# EAGLE design ATmega8_panorama-photo_v2 (EAGLE 5.10)
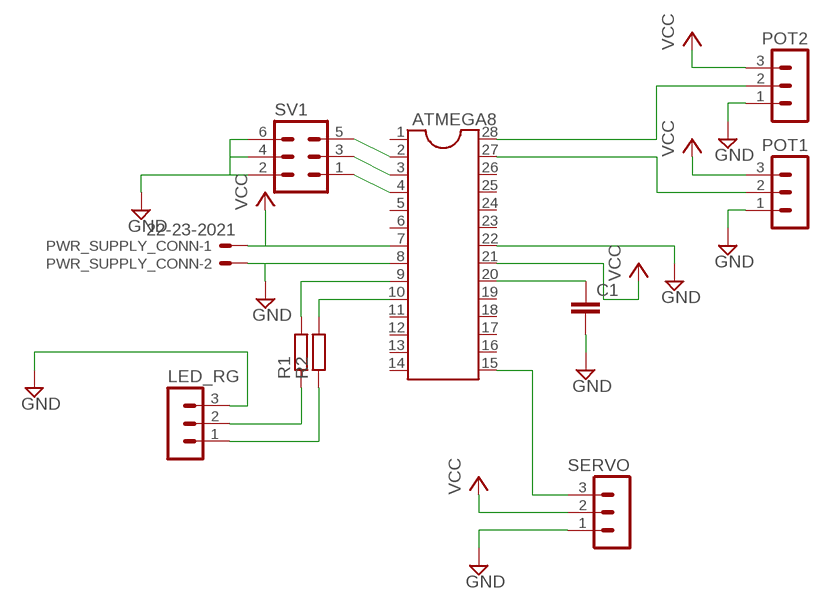
[diagram p0: schematic, sheet 1]

## Parts
ATMEGA8  DIL28-3  [DIL28-3]
C1  C5/7.2  [C5B7.2]
LED_RG  MA03-1  [MA03-1]
POT1  MA03-1  [MA03-1]
POT2  MA03-1  [MA03-1]
PWR_SUPPLY_CONN  22-23-2021  [22-23-2021]
R1  R-EU_0204/7  [0204/7]
R2  R-EU_0204/7  [0204/7]
SERVO  MA03-1  [MA03-1]
SV1  MA03-2  [MA03-2]

## Nets
AVCC: ATMEGA8.20 C1.1
BTN_INPUT1: ATMEGA8.2 SV1.5
BTN_INPUT2: ATMEGA8.3 SV1.3
BTN_INPUT3: ATMEGA8.4 SV1.1
GND: ATMEGA8.8 ATMEGA8.22 C1.2 LED_RG.3 POT1.1 POT2.1 PWR_SUPPLY_CONN.2 SERVO.1 SV1.2 SV1.4 SV1.6
LED1_COLOR1: LED_RG.1 R2.1
LED1_COLOR2: ATMEGA8.9 R1.2
N$2: ATMEGA8.10 R2.2
N$4: LED_RG.2 R1.1
POT1_ADC: ATMEGA8.27 POT1.2
POT2_ADC: ATMEGA8.28 POT2.2
SERVO1_PWM: ATMEGA8.15 SERVO.3
VCC: ATMEGA8.7 ATMEGA8.21 POT1.3 POT2.3 PWR_SUPPLY_CONN.1 SERVO.2
Unconnected: ATMEGA8.1 ATMEGA8.5 ATMEGA8.6 ATMEGA8.11 ATMEGA8.12 ATMEGA8.13 ATMEGA8.14 ATMEGA8.16 ATMEGA8.17 ATMEGA8.18 ATMEGA8.19 ATMEGA8.23 ATMEGA8.24 ATMEGA8.25 ATMEGA8.26

## Library data of the parts
ATMEGA8 = ic-package:DIL28: Dual In Line
C1 = capacitor-wima:C: CAPACITOR naming: grid - package width
LED_RG POT1 POT2 SERVO = con-lstb:MA03-1: PIN HEADER
PWR_SUPPLY_CONN = con-molex:22-23-2021: .100" (2.54mm) Center Header - 2 Pin
R1 R2 = resistor:R-EU_: RESISTOR, European symbol
SV1 = con-lstb:MA03-2: PIN HEADER

## Board
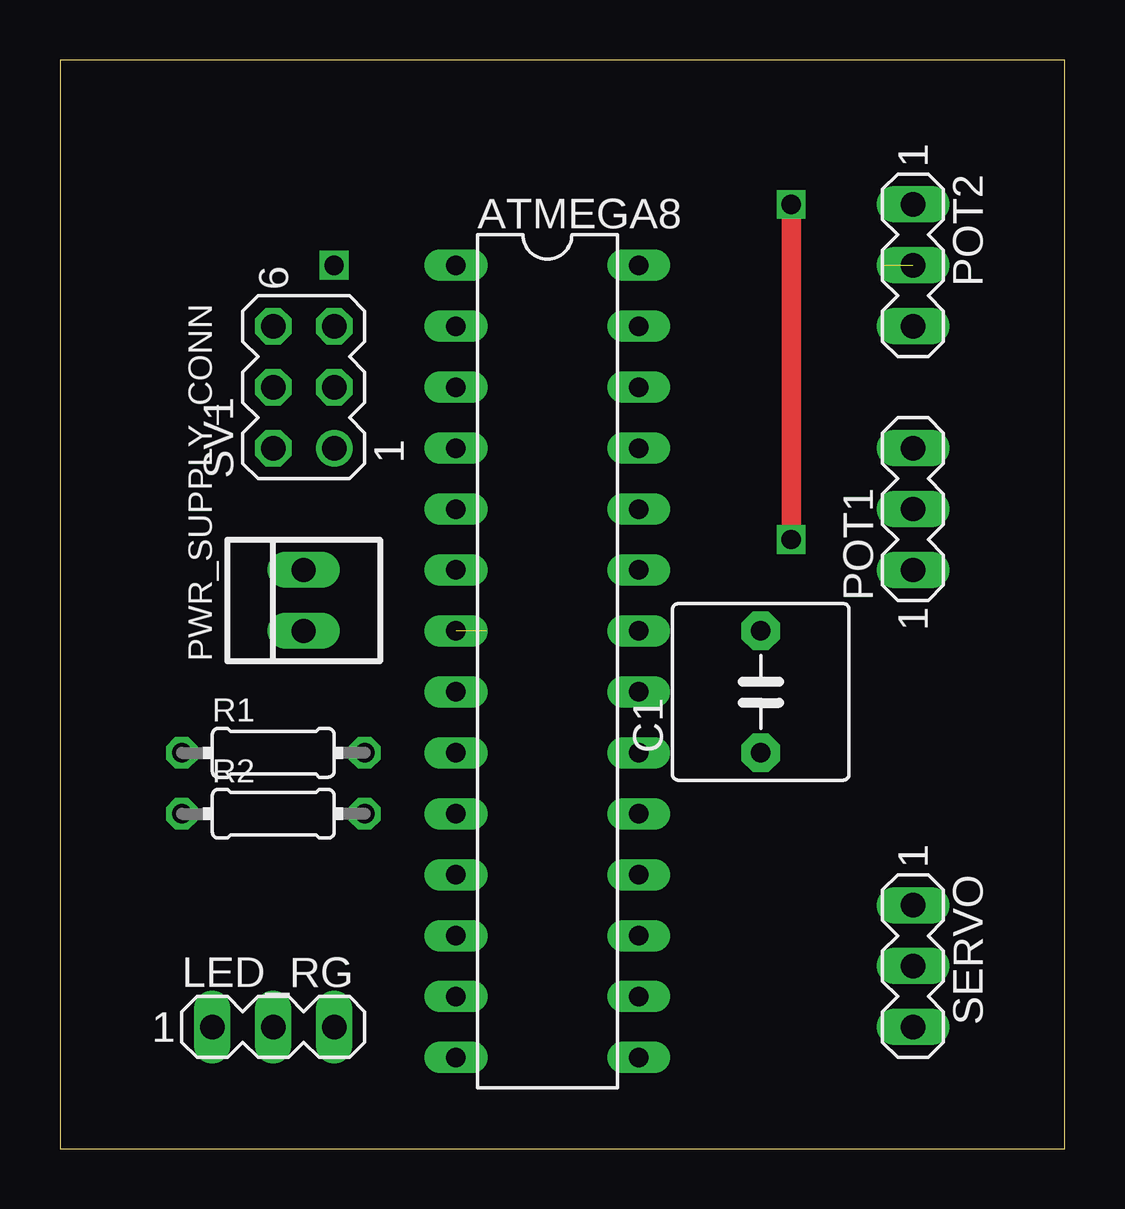
[diagram p1: board, top side]
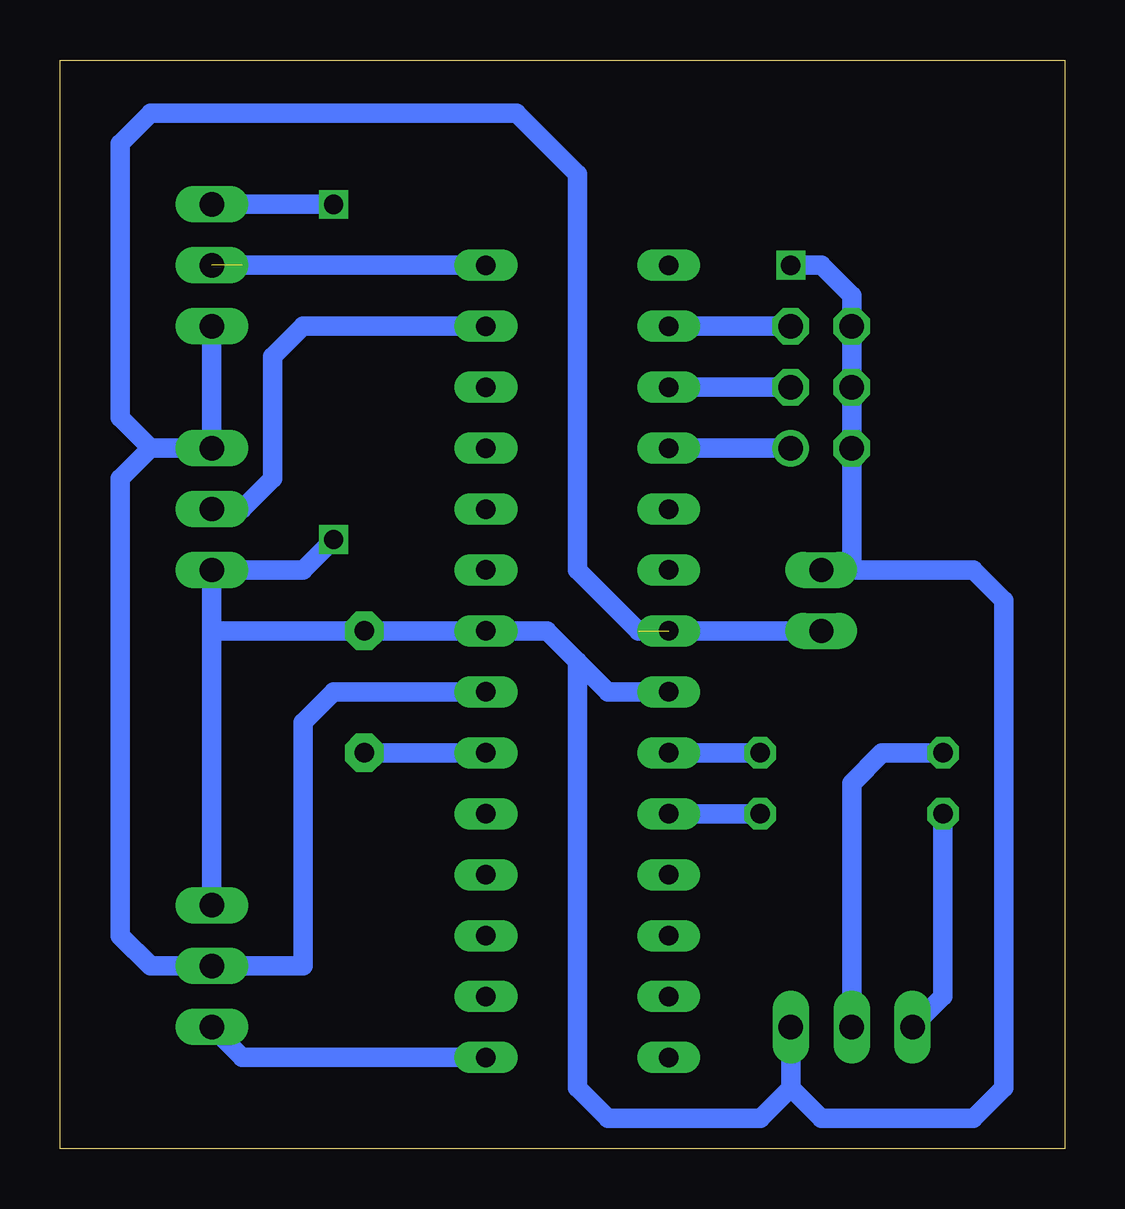
[diagram p2: board, bottom side, seen from below]

Size 41.89 x 45.39 mm. Coordinates in mm from the lower left corner, seen from the top.
Outline: 0,0 41.89,0 41.89,45.39 0,45.39 0,0
Copper layers (1*16): Top 0.035mm / dielectric 1.5mm / Bottom 0.035mm
Design rules "default": minimum track width 10mil, minimum drill 24mil, track to track 8mil, track to pad 8mil, pad to pad 8mil, via to via 8mil, smd to smd 8mil, copper to edge 40mil, drill to drill 8mil, minimum pad ring 10mil, minimum via ring 8mil, stop-mask expansion 4mil, vias tented up to drill 0mil, thermal gap 10mil

### Footprints (pad centres in the part's own frame; a part is rotated, then mirrored left to right if it is on the bottom)
DIL28-3 = drill 0.813 long: 1 -16.51,-3.81; 2 -13.97,-3.81; 3 -11.43,-3.81; 4 -8.89,-3.81; 5 -6.35,-3.81; 6 -3.81,-3.81; 7 -1.27,-3.81; 8 1.27,-3.81; 9 3.81,-3.81; 10 6.35,-3.81; 11 8.89,-3.81; 12 11.43,-3.81; 13 13.97,-3.81; 14 16.51,-3.81; 15 16.51,3.81; 16 13.97,3.81; 17 11.43,3.81; 18 8.89,3.81; 19 6.35,3.81; 20 3.81,3.81; 21 1.27,3.81; 22 -1.27,3.81; 23 -3.81,3.81; 24 -6.35,3.81; 25 -8.89,3.81; 26 -11.43,3.81; 27 -13.97,3.81; 28 -16.51,3.81
C5B7.2 = drill 0.813 pad 1.6 octagon: 1 -2.54,0; 2 2.54,0
MA03-1 = drill 1.016 long: 1 -2.54,0; 2 0,0; 3 2.54,0
22-23-2021 = drill 1 long: 1 -1.27,0; 2 1.27,0
0204/7 = drill 0.813 octagon: 1 -3.81,0; 2 3.81,0
MA03-2 = drill 1.016 round: 1 -2.54,-1.27 | drill 1.016 octagon: 2 -2.54,1.27; 3 0,-1.27; 4 0,1.27; 5 2.54,-1.27; 6 2.54,1.27

### Placement (x,y rotation side)
ATMEGA8  20.32,20.32 270 top
C1  29.21,19.05 90 top
LED_RG  8.89,5.08 0 top
POT1  35.56,26.67 90 top
POT2  35.56,36.83 270 top
PWR_SUPPLY_CONN  10.16,22.86 90 top
R1  8.89,16.51 0 top
R2  8.89,13.97 0 top
SERVO  35.56,7.62 270 top
SV1  10.16,31.75 90 top

### Tracks (layer width: path | path; a pad name or v marks a point on that pad's centre or on a via)
AVCC
  Bottom 0.813: ATMEGA8.20 C1.1
BTN_INPUT1
  Bottom 0.813: SV1.5 ATMEGA8.2
BTN_INPUT2
  Bottom 0.813: SV1.3 ATMEGA8.3
BTN_INPUT3
  Bottom 0.813: SV1.1 ATMEGA8.4
GND  (via drill 0.8)
  Top 0.813: v30.48,25.4 v30.48,39.37
  Bottom 0.813: 20.32,20.32 21.59,21.59 ATMEGA8.22 C1.2 35.56,21.59 | 35.56,21.59 POT1.1 31.75,24.13 v30.48,25.4 | 35.56,21.59 SERVO.1 | v30.48,39.37 POT2.1 | 11.43,2.54 LED_RG.3 | 11.43,2.54 10.16,1.27 3.81,1.27 2.54,2.54 2.54,22.86 3.81,24.13 8.89,24.13 | ATMEGA8.8 19.05,19.05 20.32,20.32 | 20.32,20.32 20.32,2.54 19.05,1.27 12.7,1.27 11.43,2.54 | 8.89,24.13 PWR_SUPPLY_CONN.2 | 8.89,24.13 SV1.2 SV1.4 SV1.6 8.89,35.56 10.16,36.83 v11.43,36.83
LED1_COLOR1
  Bottom 0.813: R2.1 5.08,6.35 LED_RG.1
LED1_COLOR2
  Bottom 0.813: R1.2 ATMEGA8.9
N$1  (via drill 0.8)
  other vias: 30.48,25.4
N$2
  Bottom 0.813: R2.2 ATMEGA8.10
N$3  (via drill 0.8)
  other vias: 30.48,39.37
N$4
  Bottom 0.813: LED_RG.2 8.89,15.24 7.62,16.51 R1.1
POT1_ADC
  Bottom 0.813: ATMEGA8.27 31.75,34.29 33.02,33.02 33.02,27.94 34.29,26.67 POT1.2
POT2_ADC  (1 unrouted)
  Bottom 0.813: ATMEGA8.28 34.29,36.83
SERVO1_PWM
  Bottom 0.813: ATMEGA8.15 34.29,3.81 SERVO.3
VCC  (1 unrouted)
  Bottom 0.813: 38.1,29.21 39.37,27.94 39.37,8.89 38.1,7.62 SERVO.2 31.75,7.62 31.75,17.78 30.48,19.05 ATMEGA8.21 | 38.1,29.21 POT1.3 POT2.3 | PWR_SUPPLY_CONN.1 17.78,21.59 20.32,24.13 20.32,40.64 22.86,43.18 38.1,43.18 39.37,41.91 39.37,30.48 38.1,29.21